# Altium schematic sheet 3_ADSTM32-Peripheral.SchDoc
size A; SheetNumber: 4; SheetTotal: 4
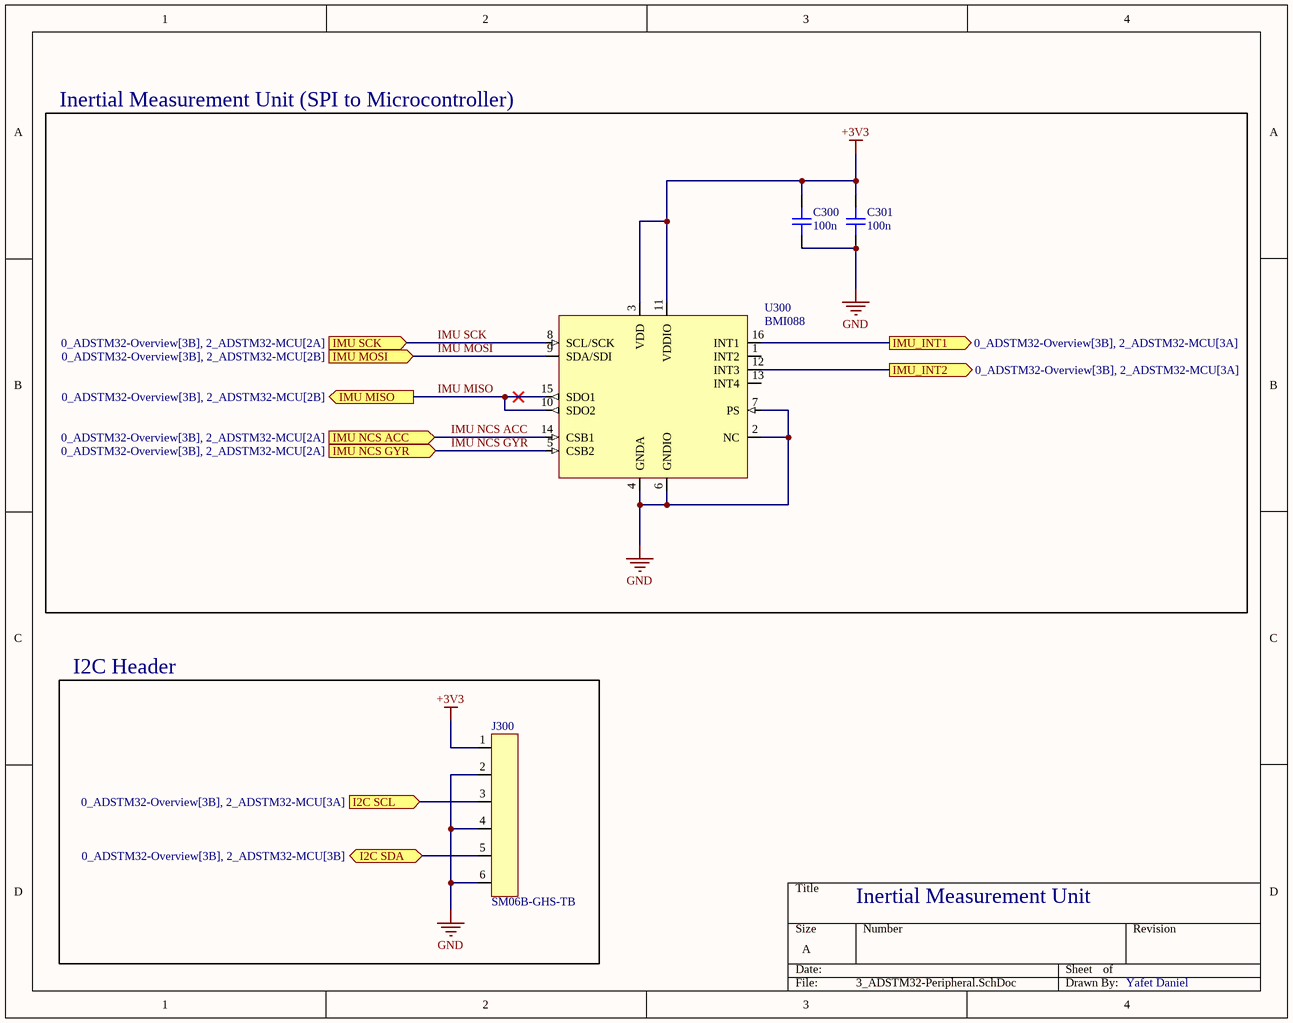
[diagram p0: 3_ADSTM32-Peripheral.SchDoc]

## Parts
C300  100n  [CAP_0603]
C301  100n  [CAP_0603]
J300  SM06B-GHS-TB  [SM06B-GHS-TB]
U300  BMI088  [BMI088]

## Blocks framed on the sheet
Inertial Measurement Unit (SPI to Microcontroller): C300 C301 U300
I2C Header: J300

## Ports
I2C SCL (in, see 0_ADSTM32-Overview[3B], 2_ADSTM32-MCU[3A]), I2C SDA (bidir, see 0_ADSTM32-Overview[3B], 2_ADSTM32-MCU[3B]), IMU MISO (out, see 0_ADSTM32-Overview[3B], 2_ADSTM32-MCU[2B]), IMU MOSI (in, see 0_ADSTM32-Overview[3B], 2_ADSTM32-MCU[2B]), IMU NCS ACC (in, see 0_ADSTM32-Overview[3B], 2_ADSTM32-MCU[2A]), IMU NCS GYR (in, see 0_ADSTM32-Overview[3B], 2_ADSTM32-MCU[2A]), IMU SCK (in, see 0_ADSTM32-Overview[3B], 2_ADSTM32-MCU[2A]), IMU_INT1 (out, see 0_ADSTM32-Overview[3B], 2_ADSTM32-MCU[3A]), IMU_INT2 (out, see 0_ADSTM32-Overview[3B], 2_ADSTM32-MCU[3A])

## Nets
+3V3: C300.2 C301.2 J300.1 U300.3(VDD) U300.11(VDDIO)
GND: C300.1 C301.1 J300.2 J300.4 J300.6 U300.2(NC) U300.4(GNDA) U300.6(GNDIO) U300.7(PS)
I2C SCL: J300.3 ; port I2C SCL
I2C SDA: J300.5 ; port I2C SDA
IMU MISO: U300.10(SDO2) U300.15(SDO1) ; port IMU MISO
IMU MOSI: U300.9(SDA/SDI) ; port IMU MOSI
IMU NCS ACC: U300.14(CSB1) ; port IMU NCS ACC
IMU NCS GYR: U300.5(CSB2) ; port IMU NCS GYR
IMU SCK: U300.8(SCL/SCK) ; port IMU SCK
IMU_INT1: U300.16(INT1) ; port IMU_INT1
IMU_INT2: U300.12(INT3) ; port IMU_INT2

Not connected (* = marked no-connect by the designer): U300 1(INT2) 13(INT4)

## Notes on the sheet
- Inertial Measurement Unit
- Yafet Daniel

## Library data of the parts
C300 C301 = CAP_0603: Capacitor SMD 0603; Manufacturer: *; Manufacturer Part Number: *; Distributor Link: *; LCSC: *; Rating: *; Dielectric: *
J300 = SM06B-GHS-TB: Header Connector 6 Position 1.25MM Pitch SMD Horizontal JST GH; Manufacturer: JST; Manufacturer Part Number: SM06B-GHS-TB
U300 = BMI088: Inertial Measurement Unit IMU 6-Axis LGA; Manufacturer: Bosch; Current Consumption: 0.006; Manufacturer Part Number: BMI088